# Altium project ANALYSIS.PrjPCB
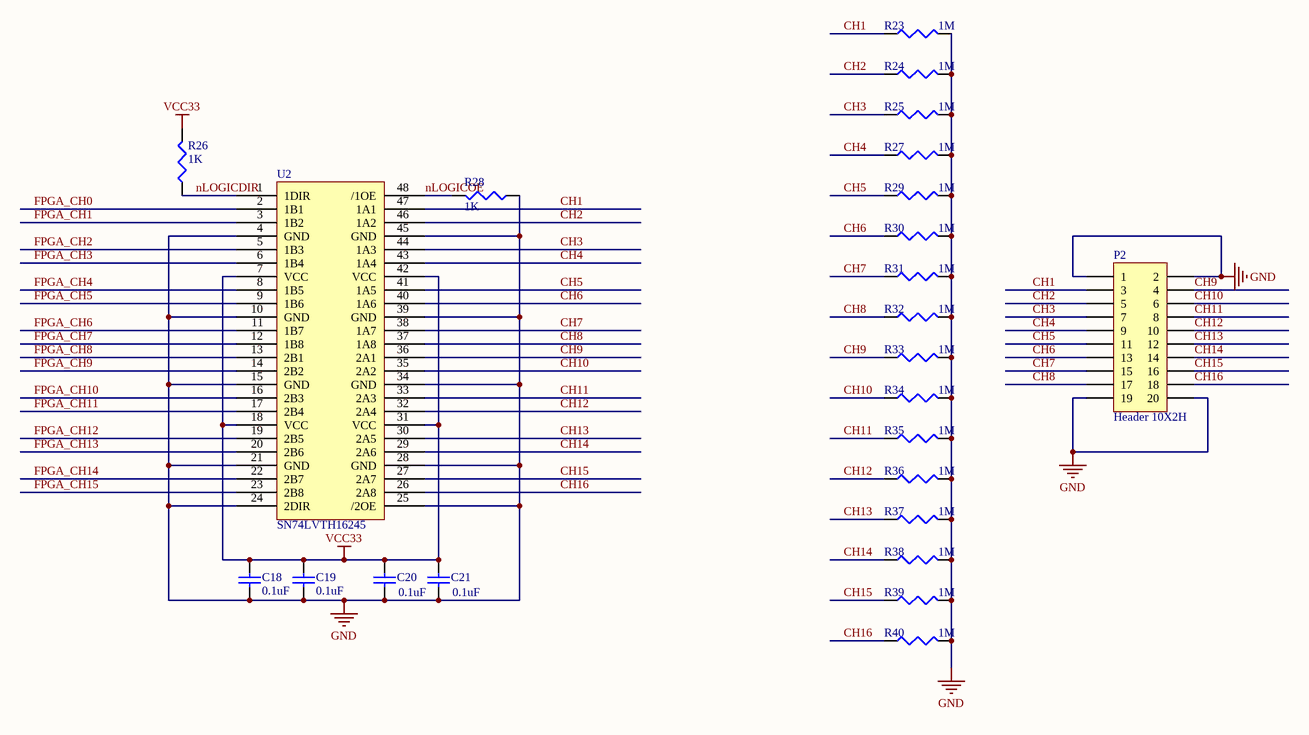
[diagram p0: Logic in.SchDoc]
2 sheets, 64 parts. Net scope: global (net labels, ports and power ports of the same name join across sheets).
Board file: XILINX_LA11.PcbDoc
Sheets:
  Logic in.SchDoc
  USB.SchDoc

## Sheet Logic in.SchDoc
size A4

### Parts
C18  value 0.1uF  [cc0603]
C19  value 0.1uF  [cc0603]
C20  value 0.1uF  [cc0603]
C21  value 0.1uF  [cc0603]
P2  Header 10X2H  [HDR2X10]
R23  value 1M  [CR0603]
R24  value 1M  [CR0603]
R25  value 1M  [CR0603]
R26  value 1K  [CR0603]
R27  value 1M  [CR0603]
R28  value 1K  [CR0603]
R29  value 1M  [CR0603]
R30  value 1M  [CR0603]
R31  value 1M  [CR0603]
R32  value 1M  [CR0603]
R33  value 1M  [CR0603]
R34  value 1M  [CR0603]
R35  value 1M  [CR0603]
R36  value 1M  [CR0603]
R37  value 1M  [CR0603]
R38  value 1M  [CR0603]
R39  value 1M  [CR0603]
R40  value 1M  [CR0603]
U2  SN74LVTH16245  [SN74HC16245]

### Nets
GND: C18.2 C19.2 C20.1 C21.1 P2.1 P2.2 P2.19 P2.20 R23.2 R24.2 R25.2 R27.2 R28.1 R29.2 R30.2 R31.2 R32.2 R33.2 R34.2 R35.2 R36.2 R37.2 R38.2 R39.2 R40.2 U2.4(GND) U2.10(GND) U2.15(GND) U2.21(GND) U2.24(2DIR) U2.25(/2OE) U2.28(GND) U2.34(GND) U2.39(GND) U2.45(GND)
VCC33: C18.1 C19.1 C20.2 C21.2 R26.2 U2.7(VCC) U2.18(VCC) U2.31(VCC) U2.42(VCC)
CH1: P2.3 R23.1 U2.47(1A1)
CH2: P2.5 R24.1 U2.46(1A2)
CH3: P2.7 R25.1 U2.44(1A3)
CH4: P2.9 R27.1 U2.43(1A4)
CH5: P2.11 R29.1 U2.41(1A5)
CH6: P2.13 R30.1 U2.40(1A6)
CH7: P2.15 R31.1 U2.38(1A7)
CH8: P2.17 R32.1 U2.37(1A8)
CH9: P2.4 R33.1 U2.36(2A1)
CH10: P2.6 R34.1 U2.35(2A2)
CH11: P2.8 R35.1 U2.33(2A3)
CH12: P2.10 R36.1 U2.32(2A4)
CH13: P2.12 R37.1 U2.30(2A5)
CH14: P2.14 R38.1 U2.29(2A6)
CH15: P2.16 R39.1 U2.27(2A7)
CH16: P2.18 R40.1 U2.26(2A8)
FPGA_CH0: U2.2(1B1)
FPGA_CH1: U2.3(1B2)
FPGA_CH2: U2.5(1B3)
FPGA_CH3: U2.6(1B4)
FPGA_CH4: U2.8(1B5)
FPGA_CH5: U2.9(1B6)
FPGA_CH6: U2.11(1B7)
FPGA_CH7: U2.12(1B8)
FPGA_CH8: U2.13(2B1)
FPGA_CH9: U2.14(2B2)
FPGA_CH10: U2.16(2B3)
FPGA_CH11: U2.17(2B4)
FPGA_CH12: U2.19(2B5)
FPGA_CH13: U2.20(2B6)
FPGA_CH14: U2.22(2B7)
FPGA_CH15: U2.23(2B8)
nLOGICDIR: R26.1 U2.1(1DIR)
nLOGICOE: R28.2 U2.48(/1OE)

### Library data of the parts
C18-C21 = Cap: Capacitor; Published: 8-Jun-2000; LatestRevisionDate: 17-Jul-2002; LatestRevisionNote: Re-released for DXP Platform.; PackageReference: RAD-0.3; Publisher: Altium Limited
P2 = Header 10X2H: Header, 10-Pin, Dual row, Right Angle; LatestRevisionDate: 17-Jul-2002; LatestRevisionNote: Re-released for DXP Platform.; Publisher: Altium Limited
R23-R40 = Res3: Resistor; Published: 8-Jun-2000; LatestRevisionDate: 04-Mar-2005; LatestRevisionNote: PCB Footprint replaced.; PackageReference: J1-0603; Publisher: Altium Limited

## Sheet USB.SchDoc
size A3
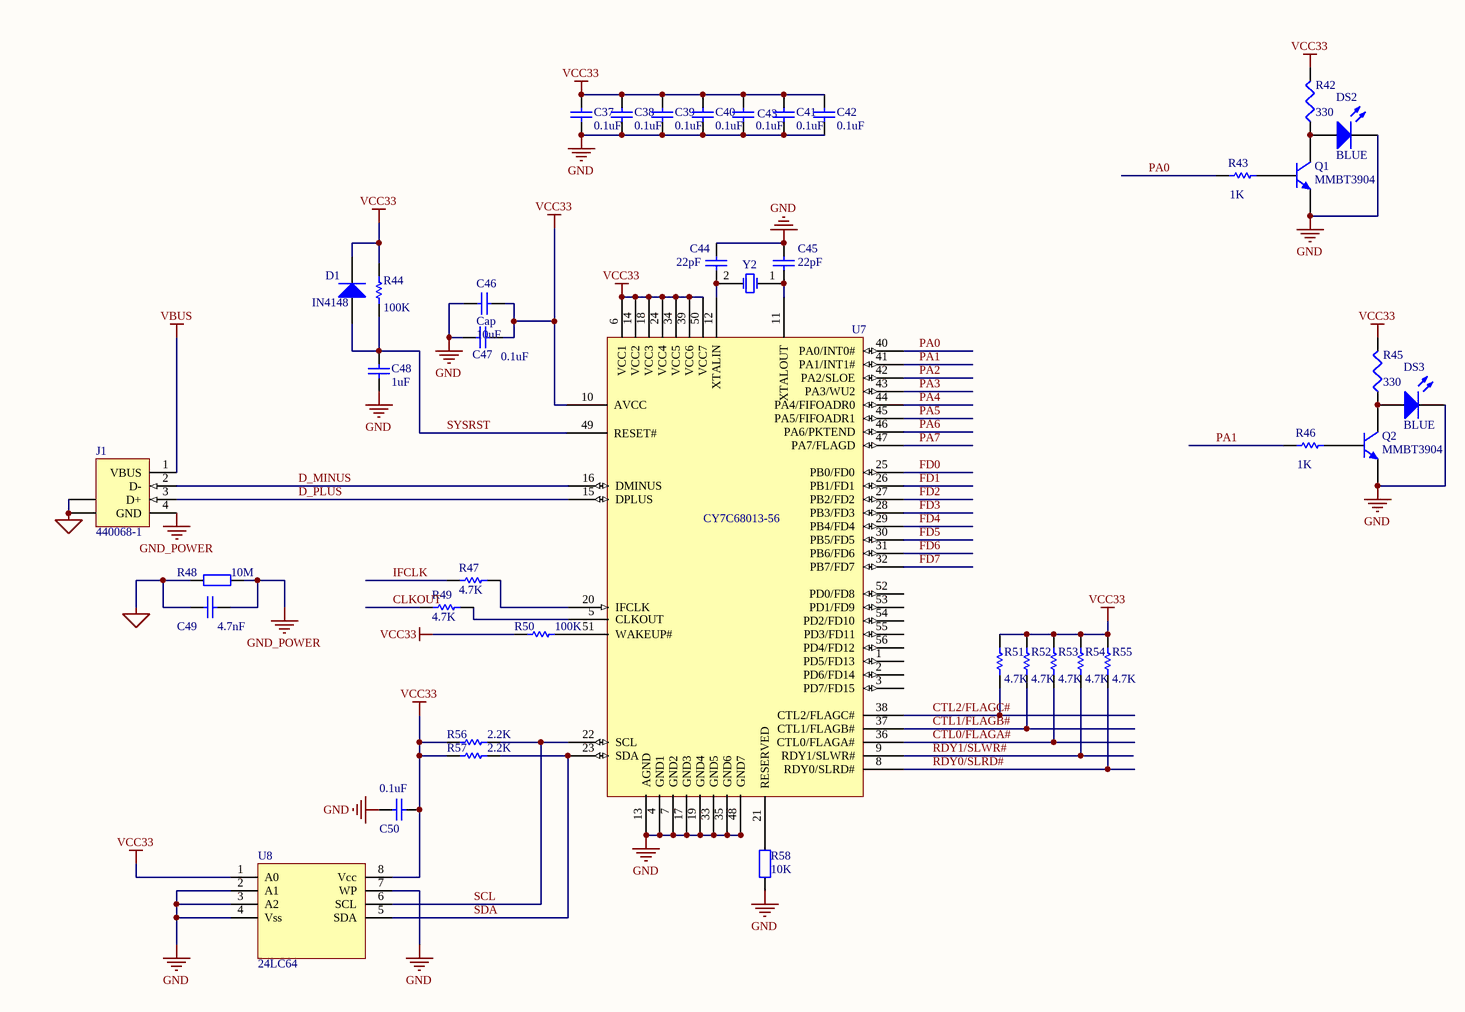
[diagram p1: USB.SchDoc]

### Parts
C37  value 0.1uF  [cc0603]  (hidden comment: Cap Semi)
C38  value 0.1uF  [cc0603]  (hidden comment: Cap Semi)
C39  value 0.1uF  [cc0603]  (hidden comment: Cap Semi)
C40  value 0.1uF  [cc0603]  (hidden comment: Cap Semi)
C41  value 0.1uF  [cc0603]  (hidden comment: Cap Semi)
C42  value 0.1uF  [cc0603]  (hidden comment: Cap Semi)
C43  value 0.1uF  [cc0603]  (hidden comment: Cap Semi)
C44  value 22pF  [cc0603]  (hidden comment: Cap Semi)
C45  value 22pF  [cc0603]  (hidden comment: Cap Semi)
C46  Cap  value 10uF  [cc0603]
C47  value 0.1uF  [cc0603]  (hidden comment: Cap Semi)
C48  value 1uF  [cc0603]  (hidden comment: Cap Semi)
C49  value 4.7nF  [4.7nF]  (hidden comment: Cap)
C50  value 0.1uF  [cc0603]  (hidden comment: Cap Semi)
D1  IN4148  [DIODE]
DS2  BLUE  [HDR1X2]
DS3  BLUE  [HDR1X2]
J1  440068-1  [USB_interface_type_B]
Q1  MMBT3904  [NPN]
Q2  MMBT3904  [NPN]
R42  value 330  [CR0603]
R43  value 1K  [CR0603]
R44  value 100K  [CR0603]  (hidden comment: Res1)
R45  value 330  [CR0603]
R46  value 1K  [CR0603]
R47  value 4.7K  [CR0603]
R48  value 10M  [CR0805]  (hidden comment: Res2)
R49  value 4.7K  [CR0603]
R50  value 100K  [CR0603]  (hidden comment: Res1)
R51  value 4.7K  [CR0603]
R52  value 4.7K  [CR0603]
R53  value 4.7K  [CR0603]
R54  value 4.7K  [CR0603]
R55  value 4.7K  [CR0603]
R56  value 2.2K  [CR0603]  (hidden comment: Res1)
R57  value 2.2K  [CR0603]  (hidden comment: Res1)
R58  value 10K  [CR0603]  (hidden comment: Res2)
U7  CY7C68013-56  [so-56]
U8  24LC64  [sop8]
Y2  XTAL  [USB_jingzhen 24M]  (value not drawn)

### Nets
GND: C37.1 C38.1 C39.1 C40.1 C41.1 C42.1 C43.1 C44.2 C45.1 C46.1 C47.1 C48.1 C50.1 DS2.2(K) DS3.2(K) Q1.1(E) Q2.1(E) R58.1 U7.4(GND1) U7.7(GND2) U7.13(AGND) U7.17(GND3) U7.19(GND4) U7.33(GND5) U7.35(GND6) U7.48(GND7) U8.2(A1) U8.3(A2) U8.4(Vss) U8.7(WP)
GND_POWER: C49.2 J1.4(GND) R48.2
USBSHEILD: C49.1 J1.5(SHLD) J1.6(SHLD) R48.1
VBUS: J1.1(VBUS)
VCC33: C37.2 C38.2 C39.2 C40.2 C41.2 C42.2 C43.2 C46.2 C47.2 C50.2 D1.2(K) R42.2 R44.2 R45.2 R50.2 R51.2 R52.2 R53.2 R54.2 R55.2 R56.1 R57.1 U7.6(VCC1) U7.10(AVCC) U7.14(VCC2) U7.18(VCC3) U7.24(VCC4) U7.34(VCC5) U7.39(VCC6) U7.50(VCC7) U8.1(A0) U8.8(Vcc)
CLKOUT: R49.2
CTL0/FLAGA#: R53.1 U7.36(CTL0/FLAGA#)
CTL1/FLAGB#: R52.1 U7.37(CTL1/FLAGB#)
CTL2/FLAGC#: R51.1 U7.38(CTL2/FLAGC#)
D_MINUS: J1.2(D-) U7.16(DMINUS)
D_PLUS: J1.3(D+) U7.15(DPLUS)
FD0: U7.25(PB0/FD0)
FD1: U7.26(PB1/FD1)
FD2: U7.27(PB2/FD2)
FD3: U7.28(PB3/FD3)
FD4: U7.29(PB4/FD4)
FD5: U7.30(PB5/FD5)
FD6: U7.31(PB6/FD6)
FD7: U7.32(PB7/FD7)
IFCLK: R47.2
PA0: R43.1 U7.40(PA0/INT0#)
PA1: R46.1 U7.41(PA1/INT1#)
PA2: U7.42(PA2/SLOE)
PA3: U7.43(PA3/WU2)
PA4: U7.44(PA4/FIFOADR0)
PA5: U7.45(PA5/FIFOADR1)
PA6: U7.46(PA6/PKTEND)
PA7: U7.47(PA7/FLAGD)
RDY0/SLRD#: R55.1 U7.8(RDY0/SLRD#)
RDY1/SLWR#: R54.1 U7.9(RDY1/SLWR#)
SCL: R56.2 U7.22(SCL) U8.6(SCL)
SDA: R57.2 U7.23(SDA) U8.5(SDA)
SYSRST: C48.2 D1.1(A) R44.1 U7.49(RESET#)
NetC44_1: C44.1 U7.12(XTALIN) Y2.2(OSC2)
NetC45_2: C45.2 U7.11(XTALOUT) Y2.1(OSC1)
NetDS2_1: DS2.1(A) Q1.3(C) R42.1
NetDS3_1: DS3.1(A) Q2.3(C) R45.1
NetQ1_2: Q1.2(B) R43.2
NetQ2_2: Q2.2(B) R46.2
NetR47_1: R47.1 U7.20(IFCLK)
NetR49_1: R49.1 U7.5(CLKOUT)
NetR50_1: R50.1 U7.51(WAKEUP#)
NetR58_2: R58.2 U7.21(RESERVED)

Not connected (* = marked no-connect by the designer): U7 1(PD5/FD13) 2(PD6/FD14) 3(PD7/FD15) 52(PD0/FD8) 53(PD1/FD9) 54(PD2/FD10) 55(PD3/FD11) 56(PD4/FD12)

### Library data of the parts
C37-C45 C47 C48 C50 = Cap Semi: Capacitor (Semiconductor SIM Model); Published: 8-Jun-2000; LatestRevisionDate: 17-Jul-2002; LatestRevisionNote: Re-released for DXP Platform.; PackageReference: C1206; Publisher: Altium Limited
C46 C49 = Cap: Capacitor; Published: 8-Jun-2000; Publisher: Altium Limited
  C46: Revision: July-2002: Re-released for DXP Platform.
  C49: LatestRevisionDate: 17-Jul-2002; LatestRevisionNote: Re-released for DXP Platform.
D1 = Diode 1N4001: 1 Amp General Purpose Rectifier; Published: 8-Jun-2000; LatestRevisionDate: 17-Jul-2002; LatestRevisionNote: Re-released for DXP Platform.; DatasheetDocument: 1998; PackageDocument: Aug-1999; PackageReference: DO-41; Publisher: Altium Limited; Code_JEDEC: DO-204-AL
DS2 DS3 = LED0: Typical INFRARED GaAs LED; Published: 8-Jun-2000; Revision: July-2002: Re-released for DXP Platform.; Publisher: Altium Limited
J1 = 440068-1: USB 1.1, Right Angle, Thru-Hole, Reverse Type, Receptacle, 4 Position, Black; ContactMaterial: Copper Alloy; ContactPlating: Gold Flash; TerminationLength: 2.40mm [0.094in.]; PCB_Layout: Complies with manufacturer's recommendation.; DrillSize: Corresponds to nominal value.; PanelGround: Without; Published: 15-Jul-2004; DatasheetDocument: 18-Mar-2004; PackageDocument: 18-Mar-2004; PackageReference: 440068; Publisher: Altium Limited; HousingMaterial: Glass-Filled Thermoplastic
Q1 Q2 = 2N3904: NPN General Purpose Amplifier; Revision 1: 11-Jul-2000: SIM Model Added.; Revision 2: 17-Jul-2002: Re-released for DXP Platform.; Revision 3: 15-Jan-2003: PCB Footprint 'BCY-W3/D4.7' replaced; Code - JEDEC: TO-92A; Published: 8-Jun-2000; Datasheet: Latest Revision: 1997; Package Reference: TO-92A; Publisher: Altium Limited
R42 R45 = Res3: Resistor; Published: 8-Jun-2000; Revision: July-2002: Re-released for DXP Platform.; Publisher: Altium Limited
R43 R44 R46 R47 R49-R57 = Res1: Resistor; Published: 8-Jun-2000; Publisher: Altium Limited
  R43 R46 R47 R49 R51-R55: Revision: July-2002: Re-released for DXP Platform.
  R44 R50 R56 R57: LatestRevisionDate: 17-Jul-2002; LatestRevisionNote: Re-released for DXP Platform.
R48 R58 = Res2: Resistor; Published: 8-Jun-2000; LatestRevisionDate: 17-Jul-2002; LatestRevisionNote: Re-released for DXP Platform.; Publisher: Altium Limited
U8 = EPCS1SI8: EPCS1 Series, In-system programmable 3.3V configuration device, 8-Pin SOIC, 1-Megabit, Industrial Grade; PackageDocument: ver11.0, Feb-2003; Configures: Cyclone FPGAs; Published: 17-Sep-2003; DatasheetDocument: ver1.1, Oct-2003; PackageReference: SOIC8; Publisher: Altium Limited; Code_JEDEC: MS-012-AA; Code_IPC: SO8
Y2 = XTAL: Crystal Oscillator; Published: 8-Jun-2000; LatestRevisionDate: 17-Jul-2002; LatestRevisionNote: Re-released for DXP Platform.; Publisher: Altium Limited

## Nets that join several sheets
GND: Logic in (35 pins), USB (30 pins)
VCC33: Logic in (9 pins), USB (32 pins)